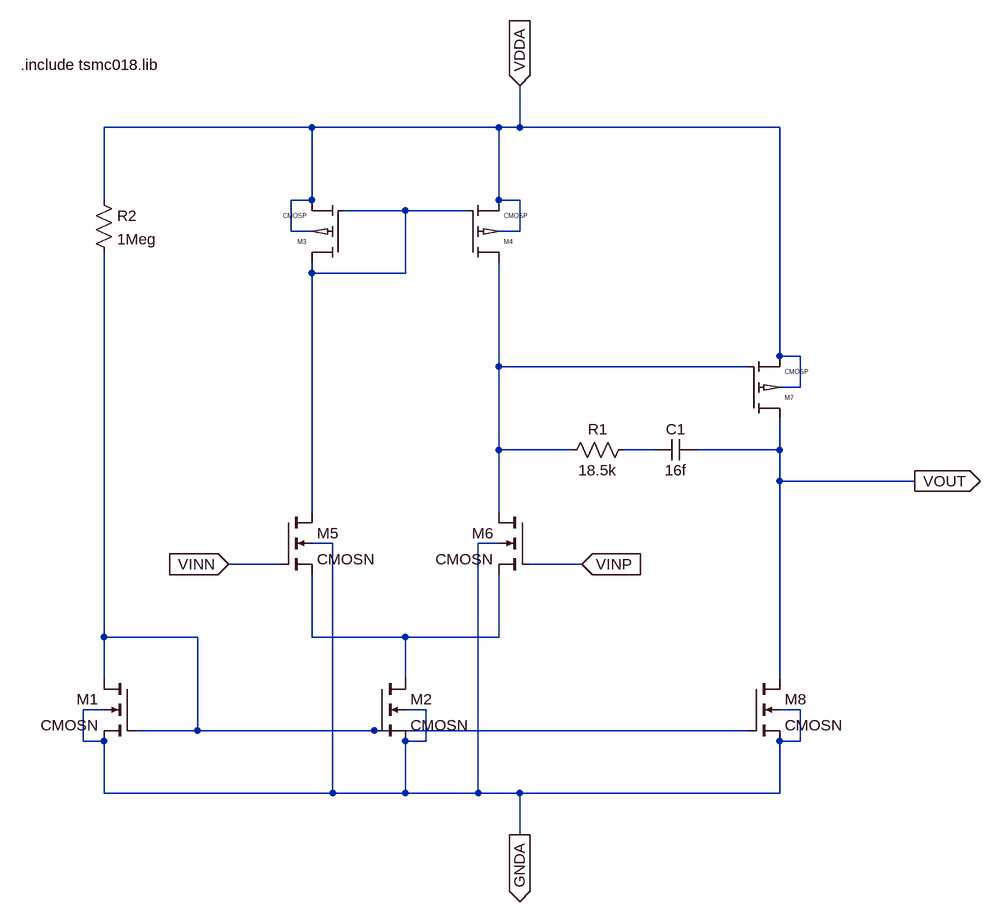
[diagram p0: schematic Nmos_Error_Amplifier.asc]
Nmos_Error_Amplifier.asc, the LTspice schematic file:
Version 4
SHEET 1 956 848
WIRE -96 -368 -416 -368
WIRE 192 -368 -96 -368
WIRE 224 -368 224 -432
WIRE 224 -368 192 -368
WIRE 624 -368 224 -368
WIRE -416 -256 -416 -368
WIRE -96 -256 -96 -368
WIRE -96 -256 -128 -256
WIRE 192 -256 192 -368
WIRE 224 -256 192 -256
WIRE 48 -240 -48 -240
WIRE 144 -240 48 -240
WIRE -128 -208 -128 -256
WIRE -96 -208 -128 -208
WIRE 224 -208 224 -256
WIRE 224 -208 192 -208
WIRE -96 -144 -96 -160
WIRE 48 -144 48 -240
WIRE 48 -144 -96 -144
WIRE 624 -16 624 -368
WIRE 656 -16 624 -16
WIRE 192 0 192 -160
WIRE 576 0 192 0
WIRE 656 32 656 -16
WIRE 656 32 624 32
WIRE 192 128 192 0
WIRE 304 128 192 128
WIRE 432 128 384 128
WIRE 624 128 624 80
WIRE 624 128 496 128
WIRE 624 176 624 128
WIRE 832 176 624 176
WIRE -96 224 -96 -144
WIRE 192 224 192 128
WIRE -64 272 -96 272
WIRE 192 272 160 272
WIRE -144 304 -224 304
WIRE 320 304 240 304
WIRE -416 416 -416 -176
WIRE -272 416 -416 416
WIRE -96 416 -96 320
WIRE 48 416 -96 416
WIRE 192 416 192 320
WIRE 192 416 48 416
WIRE -416 480 -416 416
WIRE 48 480 48 416
WIRE 624 480 624 176
WIRE -416 528 -448 528
WIRE 80 528 48 528
WIRE 656 528 624 528
WIRE -272 560 -272 416
WIRE -272 560 -368 560
WIRE 0 560 -272 560
WIRE 576 560 0 560
WIRE -448 576 -448 528
WIRE -416 576 -448 576
WIRE 80 576 80 528
WIRE 80 576 48 576
WIRE 656 576 656 528
WIRE 656 576 624 576
WIRE -416 656 -416 576
WIRE -64 656 -64 272
WIRE -64 656 -416 656
WIRE 48 656 48 576
WIRE 48 656 -64 656
WIRE 160 656 160 272
WIRE 160 656 48 656
WIRE 224 656 160 656
WIRE 624 656 624 576
WIRE 624 656 224 656
WIRE 224 720 224 656
FLAG 224 -432 VDDA
IOPIN 224 -432 In
FLAG 224 720 GNDA
IOPIN 224 720 Out
FLAG 832 176 VOUT
IOPIN 832 176 Out
FLAG -224 304 VINN
IOPIN -224 304 In
FLAG 320 304 VINP
IOPIN 320 304 In
SYMBOL cmosn -368 480 M0
SYMATTR InstName M1
SYMATTR Value2 l=180n w=1u
SYMBOL cmosn 0 480 R0
SYMATTR InstName M2
SYMATTR Value2 l=180n w=2u
SYMBOL cmosp -48 -160 R180
SYMATTR InstName M3
SYMATTR Value2 l=180n w=2u
SYMBOL cmosp 144 -160 M180
SYMATTR InstName M4
SYMATTR Value2 l=180n w=2u
SYMBOL cmosn -144 224 R0
SYMATTR InstName M5
SYMATTR Value2 l=180n w=1u
SYMBOL cmosn 240 224 M0
SYMATTR InstName M6
SYMATTR Value2 l=180n w=1u
SYMBOL cmosp 576 80 M180
SYMATTR InstName M7
SYMATTR Value2 l=180n w=10u
SYMBOL cmosn 576 480 R0
SYMATTR InstName M8
SYMATTR Value2 l=180n w=3u
SYMBOL cap 496 112 R90
WINDOW 0 0 32 VBottom 2
WINDOW 3 32 32 VTop 2
SYMATTR InstName C1
SYMATTR Value 16f
SYMBOL res 400 112 R90
WINDOW 0 0 56 VBottom 2
WINDOW 3 32 56 VTop 2
SYMATTR InstName R1
SYMATTR Value 18.5k
SYMBOL res -432 -272 R0
SYMATTR InstName R2
SYMATTR Value 1Meg
TEXT -544 -464 Left 2 !.include tsmc018.lib

The netlist it stands for:
* Nmos_Error_Amplifier.asc
M1 N004 N004 GNDA GNDA CMOSN l=180n w=1u
M2 N005 N004 GNDA GNDA CMOSN l=180n w=2u
M3 N001 N001 VDDA VDDA CMOSP l=180n w=2u
M4 N002 N001 VDDA VDDA CMOSP l=180n w=2u
M5 N001 VINN N005 GNDA CMOSN l=180n w=1u
M6 N002 VINP N005 GNDA CMOSN l=180n w=1u
M7 VOUT N002 VDDA VDDA CMOSP l=180n w=10u
M8 VOUT N004 GNDA GNDA CMOSN l=180n w=3u
C1 VOUT N003 16f
R1 N003 N002 18.5k
R2 VDDA N004 1Meg
.model NMOS NMOS
.model PMOS PMOS
.lib standard.mos
.include tsmc018.lib
.lib tsmc018.lib
.backanno
.end